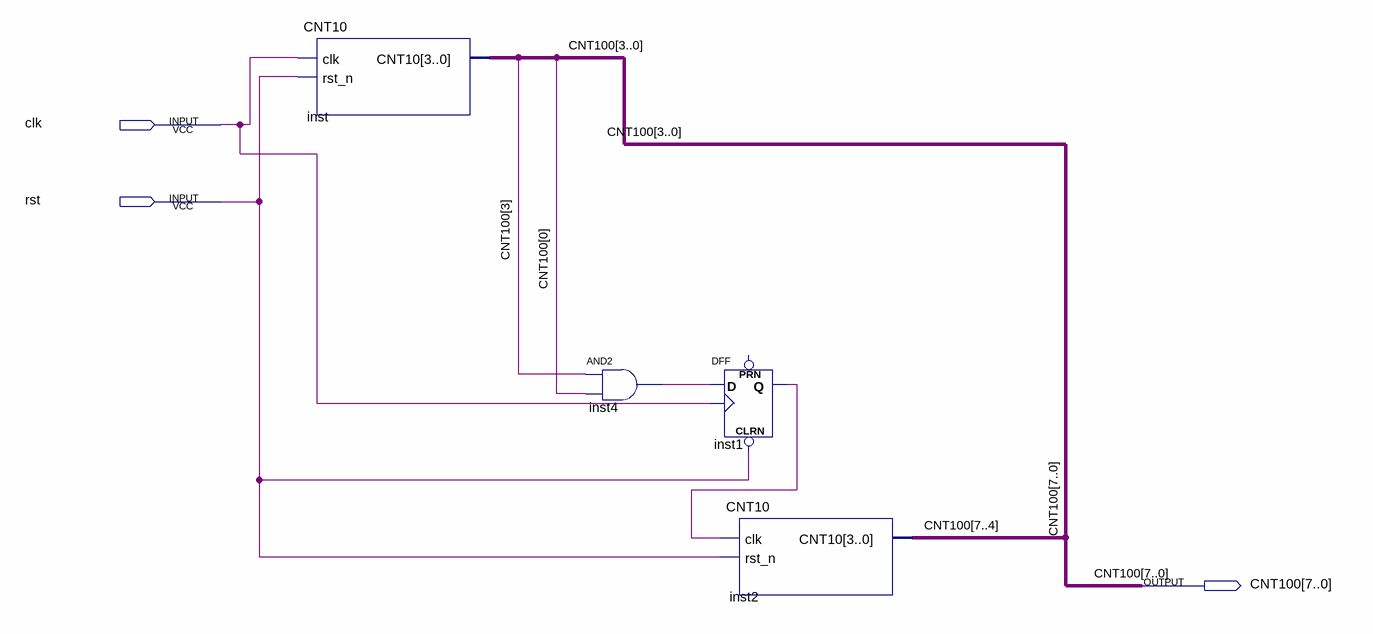
[diagram p0: schematic sheet]
// Quartus schematic practice1.bdf as structural Verilog: 4 symbols, 3 pins
module practice1 (
  input  clk,
  input  rst,
  output [7:0] CNT100
);

  wire inst1_q, inst4_out;

  CNT10 inst (.clk(clk), .rst_n(rst), .CNT10(CNT100[3:0]));
  and inst4 (inst4_out, CNT100[3], CNT100[0]);
  DFF inst1 (.CLRN(rst), .CLK(clk), .D(inst4_out), .Q(inst1_q));  // open: PRN
  CNT10 inst2 (.clk(inst1_q), .rst_n(rst), .CNT10(CNT100[7:4]));
endmodule
